# EAGLE schematic Sismin_ATmega328P_fix_v2 (EAGLE 9.7.0)
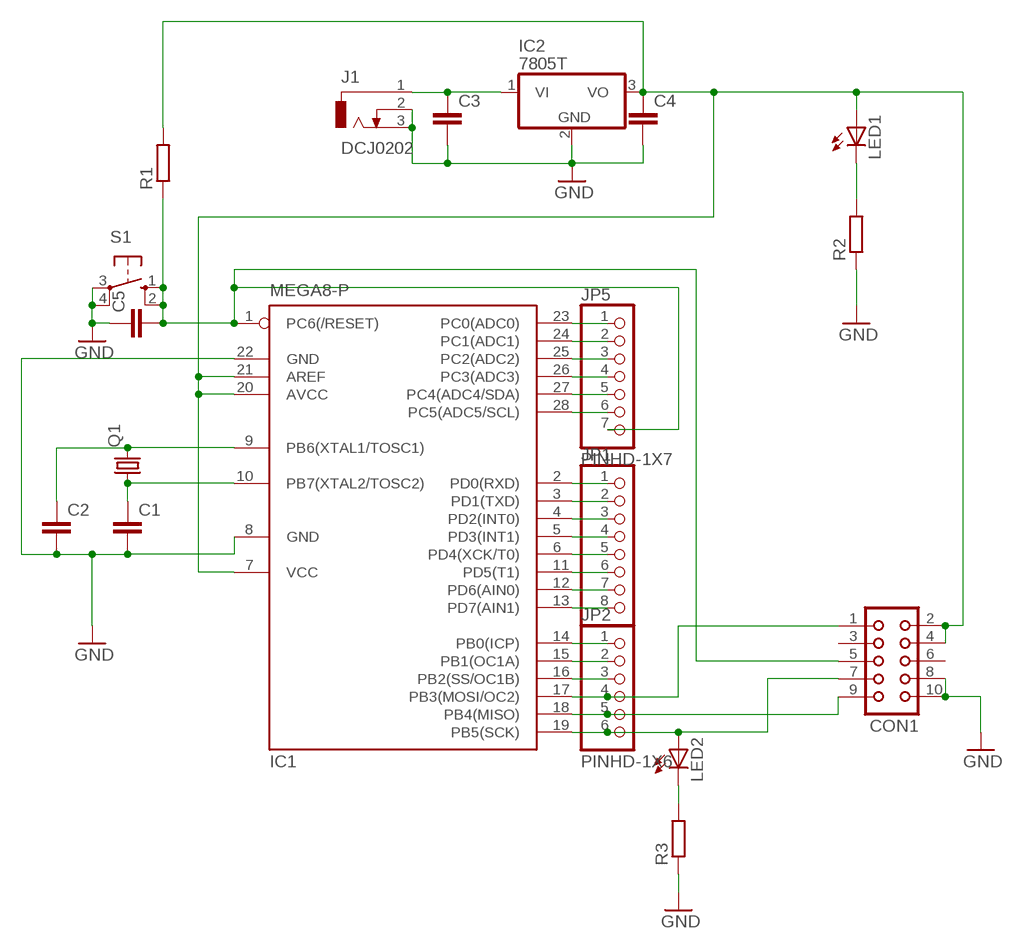
[diagram p0: schematic, sheet 1]

## Parts
C1  C-EU025-030X050  [C025-030X050]
C2  C-EU025-030X050  [C025-030X050]
C3  C-EU025-030X050  [C025-030X050]
C4  C-EU025-030X050  [C025-030X050]
C5  C-EU025-030X050  [C025-030X050]
CON1  CON10  [CON10]
IC1  MEGA8-P  [DIL28-3]
IC2  7805T  [TO220H]
J1  DCJ0202  [DCJ0202]
JP1  PINHD-1X8  [1X08]
JP2  PINHD-1X6  [1X06]
JP5  PINHD-1X7  [1X07]
LED1  LED3MM  [LED3MM]
LED2  LED3MM  [LED3MM]
Q1  CRYSTALHC49U-V  [HC49U-V]
R1  R-EU_0204/7  [0204/7]
R2  R-EU_0204/7  [0204/7]
R3  R-EU_0204/7  [0204/7]
S1  10-XX  [B3F-10XX]

## Nets
GND: C1.2 C2.2 C3.2 C4.2 C5.1 CON1.8 CON1.10 IC1.8(GND) IC1.22(GND) IC2.2(GND) J1.2 J1.3 R2.1 R3.1 S1.3(P) S1.4(P1)
N$1: C3.1 IC2.1(VI) J1.1
N$2: C4.1 CON1.2 CON1.4 IC1.7(VCC) IC1.20(AVCC) IC1.21(AREF) IC2.3(VO) LED1.A R1.2
N$3: LED1.K(C) R2.2
N$4: LED2.K(C) R3.2
N$5: IC1.23(PC0(ADC0)) JP5.1
N$6: IC1.24(PC1(ADC1)) JP5.2
N$7: IC1.25(PC2(ADC2)) JP5.3
N$8: IC1.26(PC3(ADC3)) JP5.4
N$9: IC1.27(PC4(ADC4/SDA)) JP5.5
N$10: IC1.28(PC5(ADC5/SCL)) JP5.6
N$11: IC1.2(PD0(RXD)) JP1.1
N$12: CON1.1 IC1.17(PB3(MOSI/OC2)) JP2.4
N$13: CON1.9 IC1.18(PB4(MISO)) JP2.5
N$14: IC1.3(PD1(TXD)) JP1.2
N$15: IC1.4(PD2(INT0)) JP1.3
N$16: IC1.5(PD3(INT1)) JP1.4
N$17: IC1.6(PD4(XCK/T0)) JP1.5
N$18: IC1.11(PD5(T1)) JP1.6
N$19: IC1.12(PD6(AIN0)) JP1.7
N$20: IC1.13(PD7(AIN1)) JP1.8
N$21: C2.1 IC1.9(PB6(XTAL1/TOSC1)) Q1.2
N$22: C1.1 IC1.10(PB7(XTAL2/TOSC2)) Q1.1
N$23: C5.2 CON1.5 IC1.1(PC6(/RESET)) JP5.7 R1.1 S1.1(S) S1.2(S1)
N$24: IC1.14(PB0(ICP)) JP2.1
N$26: IC1.15(PB1(OC1A)) JP2.2
N$27: IC1.16(PB2(SS/OC1B)) JP2.3
N$28: CON1.7 IC1.19(PB5(SCK)) JP2.6 LED2.A
Unconnected: CON1.3 CON1.6

## Library data of the parts
C1-C5 = rcl:C-EU: CAPACITOR, European symbol
CON1 = con-harting:CON10: CONNECTOR; OC_FARNELL: unknown; OC_NEWARK: unknown
IC1 = atmel:MEGA8-P: MICROCONTROLLER 8 Kbytes FLASH, 1 kbytes SRAM, 512 bytes EEPROM, USART, 4-channel 10 bit ADC, 2-channel 8 bit ADC Pin compatible with Atmega48, ATMega88, ATMega168 Source: avr.lbr; OC_FARNELL: unknown; OC_NEWARK: unknown
IC2 = linear:78*: Positive VOLTAGE REGULATOR Source: http://cache.national.com/ds/LM/LM78L05.pdf http://www.fairchildsemi.com/ds/LM/LM7805.pdf
J1 = con-jack:DCJ0202: DC POWER JACK Source: DCJ0202.pdf; OC_FARNELL: unknown; OC_NEWARK: unknown
JP1 = Connector:PINHD-1X8: PIN HEADER; CATEGORY: Headers; DESCRIPTION: Header, Straight, 8 Position; MANUFACTURER: Generic; MPN: Generic; OPERATING_TEMPERATURE: Generic; PART_STATUS: Active; PITCH: 0.100" (2.54mm); ROHS_COMPLIANCE: Generic; SERIES: Generic; SUB-CATEGORY: Headers, Male Pins; TYPE: Board to Board or Cable, Unshrouded, Through Hole, Straight
JP2 = Connector:PINHD-1X6: PIN HEADER; CATEGORY: Headers; DESCRIPTION: Header, Straight, 6 Position; MANUFACTURER: Generic; MPN: Generic; OPERATING_TEMPERATURE: Generic; PART_STATUS: Active; PITCH: 0.100" (2.54mm); ROHS_COMPLIANCE: Generic; SERIES: Generic; SUB-CATEGORY: Headers, Male Pins; TYPE: Board to Board or Cable, Unshrouded, Through Hole, Straight
JP5 = Connector:PINHD-1X7: PIN HEADER; CATEGORY: Headers; DESCRIPTION: Header, Straight, 7 Position; MANUFACTURER: Generic; MPN: Generic; OPERATING_TEMPERATURE: Generic; PART_STATUS: Active; PITCH: 0.100" (2.54mm); ROHS_COMPLIANCE: Generic; SERIES: Generic; SUB-CATEGORY: Headers, Male Pins; TYPE: Board to Board or Cable, Unshrouded, Through Hole, Straight
LED1 LED2 = led:LED: LED OSRAM: - CHIPLED LG R971, LG N971, LY N971, LG Q971, LY Q971, LO R971, LY R971 LH N974, LH R974 LS Q976, LO Q976, LY Q976 LO Q996 - Hyper CHIPLED LW Q18S LB Q993, LB Q99A, LB R99A - SideLED LS A670, LO A670, LY A670, LG A670, LP A670 LB A673, LV A673, LT A673, LW A673 LH A674 LY A675 LS A676, LA A676, LO A676, LY A676, LW A676 LS A679, LY A679, LG A679 - Hyper Micro SIDELED® LS Y876, LA Y876, LO Y876, LY Y876 LT Y87S - SmartLED LW L88C, LW L88S LB L89C, LB L89S, LG L890 LS L89K, LO L89K, LY L89K LS L896, LA L896, LO L896, LY L896 - TOPLED LS T670, LO T670, LY T670, LG T670, LP T670 LSG T670, LSP T670, LSY T670, LOP T670, LYG T670 LG T671, LOG T671, LSG T671 LB T673, LV T673, LT T673, LW T673 LH T674 LS T676, LA T676, LO T676, LY T676, LB T676, LH T676, LSB T676, LW T676 LB T67C, LV T67C, LT T67C, LS T67K, LO T67K, LY T67K, LW E67C LS E67B, LA E67B, LO E67B, LY E67B, LB E67C, LV E67C, LT E67C LW T67C LS T679, LY T679, LG T679 LS T770, LO T770, LY T770, LG T770, LP T770 LB T773, LV T773, LT T773, LW T773 LH T774 LS E675, LA E675, LY E675, LS T675 LS T776, LA T776, LO T776, LY T776, LB T776 LHGB T686 LT T68C, LB T68C - Hyper Mini TOPLED® LB M676 - Mini TOPLED Santana® LG M470 LS M47K, LO M47K, LY M47K Source: http://www.osram.convergy.de LUXEON: - LUMILED® LXK2-PW12-R00, LXK2-PW12-S00, LXK2-PW14-U00, LXK2-PW14-V00 LXK2-PM12-R00, LXK2-PM12-S00, LXK2-PM14-U00 LXK2-PE12-Q00, LXK2-PE12-R00, LXK2-PE12-S00, LXK2-PE14-T00, LXK2-PE14-U00 LXK2-PB12-K00, LXK2-PB12-L00, LXK2-PB12-M00, LXK2-PB14-N00, LXK2-PB14-P00, LXK2-PB14-Q00 LXK2-PR12-L00, LXK2-PR12-M00, LXK2-PR14-Q00, LXK2-PR14-R00 LXK2-PD12-Q00, LXK2-PD12-R00, LXK2-PD12-S00 LXK2-PH12-R00, LXK2-PH12-S00 LXK2-PL12-P00, LXK2-PL12-Q00, LXK2-PL12-R00 Source: www.luxeon.com KINGBRIGHT: KA-3528ASYC Source: www.kingbright.com
Q1 = crystal:CRYSTAL: CRYSTAL; OC_FARNELL: 1666969; OC_NEWARK: unknown
R1-R3 = rcl:R-EU_: RESISTOR, European symbol
S1 = switch-omron:10-XX: OMRON SWITCH; MPN: B3F-1000; OC_FARNELL: 176432; OC_NEWARK: 36M3542